# Altium schematic sheet UART-Interface.SchDoc
size A4
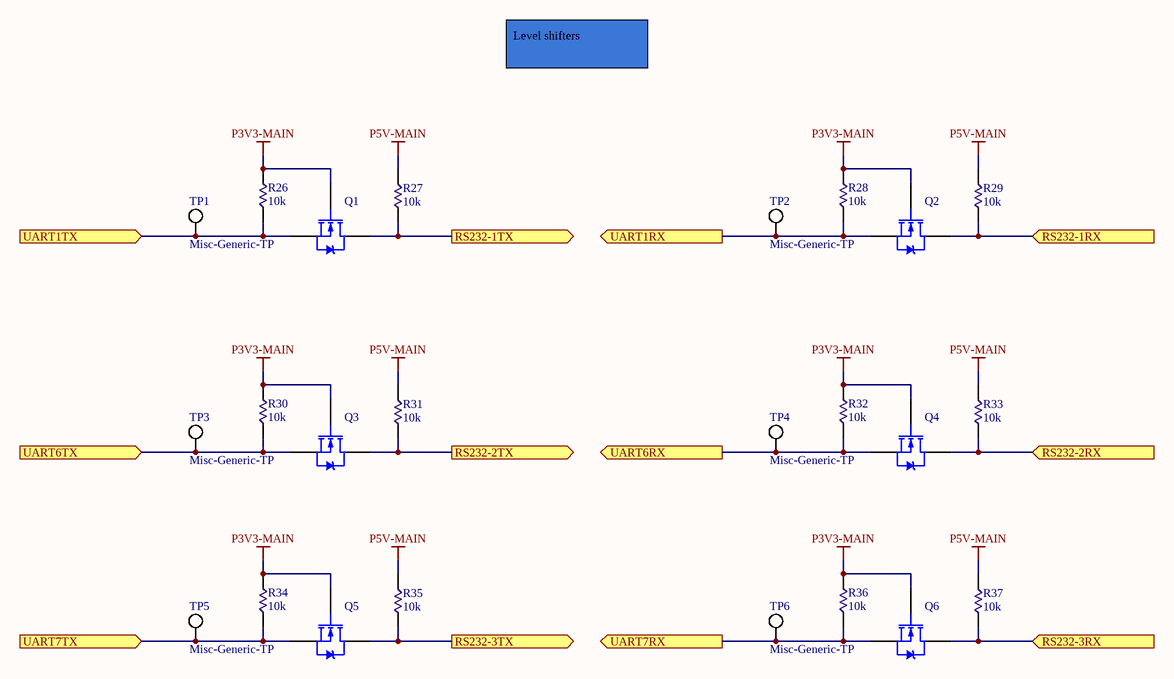
[diagram p0: UART-Interface.SchDoc]

## Parts
Q1  BSS138Q-7-F  [FOOTPRINT-DINC-SOT23-1G2S3D]  (value not drawn)
Q2  BSS138Q-7-F  [FOOTPRINT-DINC-SOT23-1G2S3D]  (value not drawn)
Q3  BSS138Q-7-F  [FOOTPRINT-DINC-SOT23-1G2S3D]  (value not drawn)
Q4  BSS138Q-7-F  [FOOTPRINT-DINC-SOT23-1G2S3D]  (value not drawn)
Q5  BSS138Q-7-F  [FOOTPRINT-DINC-SOT23-1G2S3D]  (value not drawn)
Q6  BSS138Q-7-F  [FOOTPRINT-DINC-SOT23-1G2S3D]  (value not drawn)
R26  value 10k  [FOOTPRINT-0805-GEN]  (hidden comment: SMC)
R27  value 10k  [FOOTPRINT-0805-GEN]  (hidden comment: SMC)
R28  value 10k  [FOOTPRINT-0805-GEN]  (hidden comment: SMC)
R29  value 10k  [FOOTPRINT-0805-GEN]  (hidden comment: SMC)
R30  value 10k  [FOOTPRINT-0805-GEN]  (hidden comment: SMC)
R31  value 10k  [FOOTPRINT-0805-GEN]  (hidden comment: SMC)
R32  value 10k  [FOOTPRINT-0805-GEN]  (hidden comment: SMC)
R33  value 10k  [FOOTPRINT-0805-GEN]  (hidden comment: SMC)
R34  value 10k  [FOOTPRINT-0805-GEN]  (hidden comment: SMC)
R35  value 10k  [FOOTPRINT-0805-GEN]  (hidden comment: SMC)
R36  value 10k  [FOOTPRINT-0805-GEN]  (hidden comment: SMC)
R37  value 10k  [FOOTPRINT-0805-GEN]  (hidden comment: SMC)
TP1  Misc-Generic-TP  [FOOTPRINT-GENERIC-TP-VIA-1MM]
TP2  Misc-Generic-TP  [FOOTPRINT-GENERIC-TP-VIA-1MM]
TP3  Misc-Generic-TP  [FOOTPRINT-GENERIC-TP-VIA-1MM]
TP4  Misc-Generic-TP  [FOOTPRINT-GENERIC-TP-VIA-1MM]
TP5  Misc-Generic-TP  [FOOTPRINT-GENERIC-TP-VIA-1MM]
TP6  Misc-Generic-TP  [FOOTPRINT-GENERIC-TP-VIA-1MM]

## Ports
RS232-1RX (in), RS232-1TX (out), RS232-2RX (in), RS232-2TX (out), RS232-3RX (in), RS232-3TX (out), UART1RX (out), UART1TX (in), UART6RX (out), UART6TX (in), UART7RX (out), UART7TX (in)

## Nets
P3V3-MAIN: Q1.1(G) Q2.1(G) Q3.1(G) Q4.1(G) Q5.1(G) Q6.1(G) R26.2 R28.2 R30.2 R32.2 R34.2 R36.2
P5V-MAIN: R27.1 R29.1 R31.1 R33.1 R35.1 R37.1
RS232-1RX: Q2.3(D) R29.2 ; port RS232-1RX
RS232-1TX: Q1.3(D) R27.2 ; port RS232-1TX
RS232-2RX: Q4.3(D) R33.2 ; port RS232-2RX
RS232-2TX: Q3.3(D) R31.2 ; port RS232-2TX
RS232-3RX: Q6.3(D) R37.2 ; port RS232-3RX
RS232-3TX: Q5.3(D) R35.2 ; port RS232-3TX
UART1RX: Q2.2(S) R28.1 TP2.1(TP) ; port UART1RX
UART1TX: Q1.2(S) R26.1 TP1.1(TP) ; port UART1TX
UART6RX: Q4.2(S) R32.1 TP4.1(TP) ; port UART6RX
UART6TX: Q3.2(S) R30.1 TP3.1(TP) ; port UART6TX
UART7RX: Q6.2(S) R36.1 TP6.1(TP) ; port UART7RX
UART7TX: Q5.2(S) R34.1 TP5.1(TP) ; port UART7TX

## Notes on the sheet
- Level shifters
- Title
- Size:
- Date:
- Engineer
- A4
- Number:
- Sheet
- of
- Approved
- Revision:
- UC Riverside
- www.highlanderracing.org <https://www.highlanderracing.org>
- File:

## Library data of the parts
Q1-Q6 = Transistor-DiodesInc-BSS138-1G2S3D: N-Channel Logic Level Enhancement Mode Field Effect Transistor; Note: Pin 2 is electrically connected to pin 4.; Published: 8-Jun-2000; LatestRevisionDate: 17-Jul-2002; LatestRevisionNote: Re-released for DXP Platform.; DatasheetVersion: PD-9.814; PackageVersion: Feb-1997; PackageReference: TO-220AB; Publisher: Altium Limited; PackageDescription: TO, Thru-Hole, Vertical, Heatsink Mounted; 3 In-Line Leads; Pitch 2.54 mm; ComponentLink1Description: Manufacturer Link; ComponentLink1URL: http://www.irf.com/
R26-R37 = Resistor-Generic-0805-2012: 1/8 Watt Surface Mount Resistor